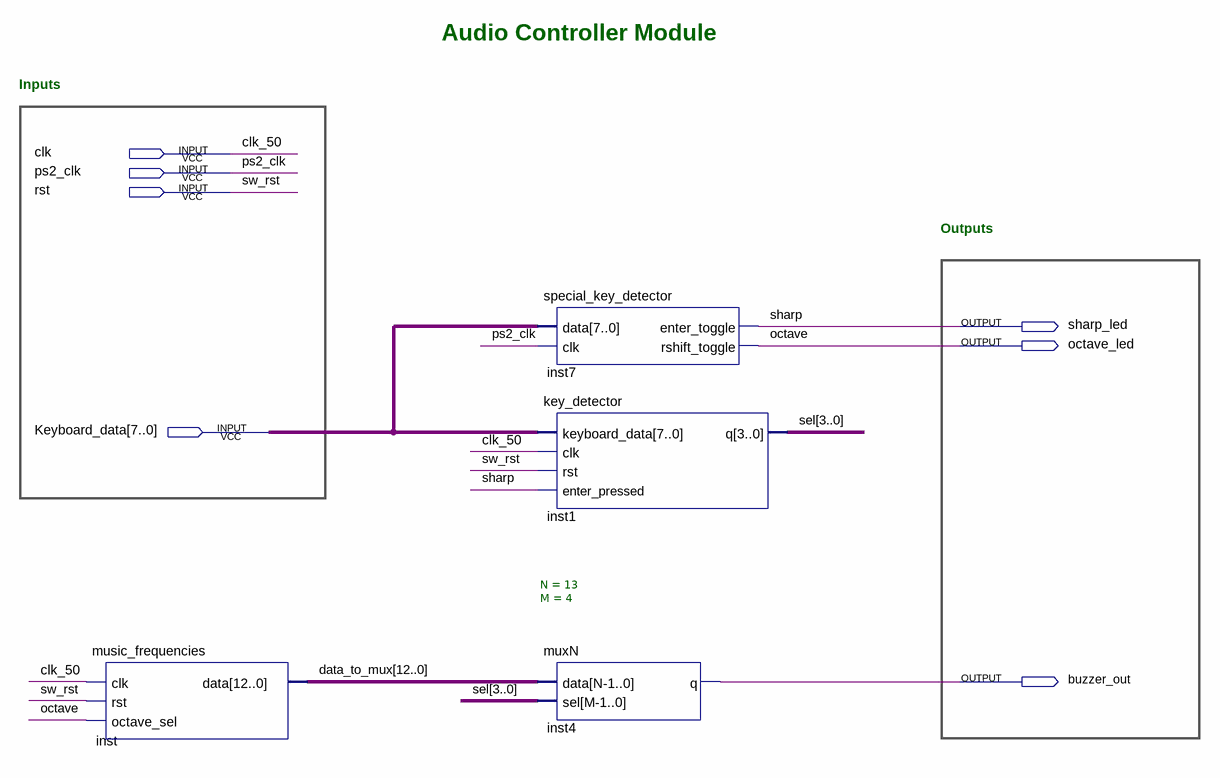
[diagram p0: schematic sheet]
// Quartus schematic AudioController.bdf as structural Verilog: 4 symbols, 7 pins
module AudioController (
  input  clk,
  input  ps2_clk,
  input  rst,
  input  [7:0] Keyboard_data,
  output sharp_led,
  output octave_led,
  output buzzer_out
);

  wire [3:0] sel;
  wire [12:0] data_to_mux;

  music_frequencies inst (.clk(clk), .rst(rst), .octave_sel(octave_led), .data(data_to_mux));
  special_key_detector inst7 (
    .data(Keyboard_data), .clk(ps2_clk), .enter_toggle(sharp_led), .rshift_toggle(octave_led));
  key_detector inst1 (.keyboard_data(Keyboard_data), .clk(clk), .rst(rst), .enter_pressed(sharp_led), .q(sel));
  muxN #(.N(13), .M(4)) inst4 (.data(data_to_mux), .sel(sel), .q(buzzer_out));

  // Other names for the same wires on the sheet: clk_50 = clk; octave = octave_led; sharp = sharp_led; sw_rst = rst

  // Notes on the sheet:
  //   Audio Controller Module
  //   Inputs
  //   Outputs
endmodule
